# EasyEDA Pro project ProPrj_IoT House_2026-04-28.epro, board PCB6
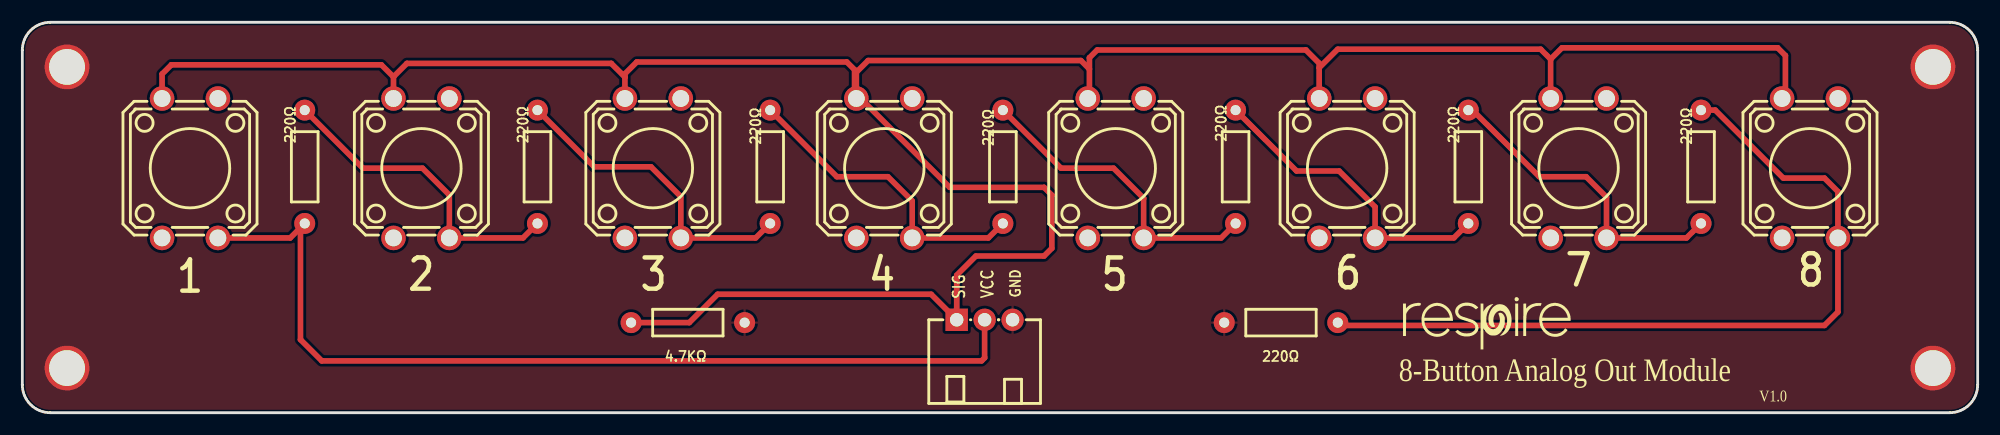
[diagram p11: board, top side]
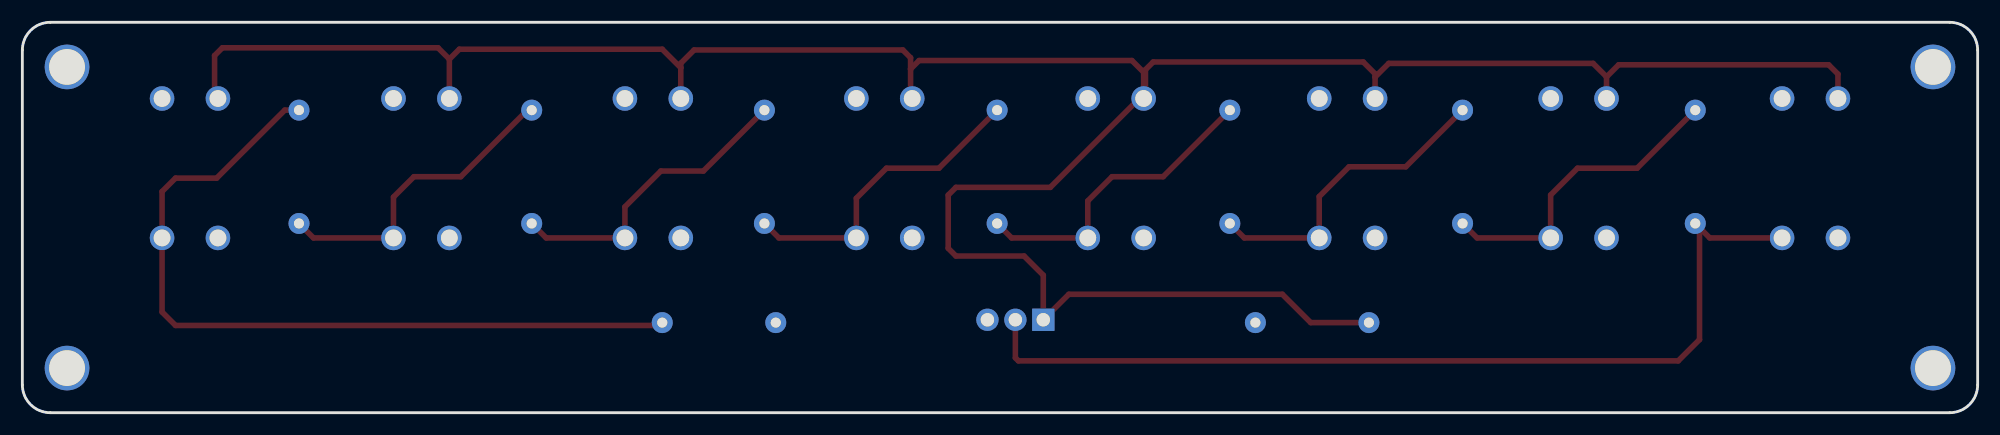
[diagram p12: board, bottom side, seen from below]

Outline 175 x 35 mm; copper layers: Top Layer, Bottom Layer. Coordinates in mm from the lower left corner of the outline.
Outline path: 0,32.5 0,2.5 arc(0.73,0.73) 2.5,0 172.5,0 arc(174.27,0.73) 175,2.5 175,32.5 arc(174.27,34.27) 172.5,35 2.5,35 arc(0.73,34.27) 0,32.5
Stack: Top Layer 0.035mm / Dielectric1 1.51mm FR4 er 4.5 / Bottom Layer 0.035mm

## Design rules (mm)
template: Custom Config
spacing copperThickness1oz (default): track to track 0.102, other pairs 0.152 to 0.3
spacing copperThickness2oz: track to track 0.203, other pairs 0.152 to 0.3
track width copperThickness1oz (default): min 0.127, default 0.5, max 2.54
track width copperThickness2oz: min 0.203, default 0.5, max 2.54
differential pair differentialPair (default): width min 0.127, default 0.254, max 2.54; gap min 0.152, default 0.152
via viaSize (default): diameter min 0.5, default 0.61, max 10; hole min 0.3, default 0.305, max 6.3

## Placement (name value [footprint] x y rotation side)
4.7KΩ  10KΩ  [R_AXIAL-0.4]  59.56 8.08 0 top
220Ω  -  [R_AXIAL-0.4]  46.1 22.05 270 top
220Ω#2  -  [R_AXIAL-0.4]  66.93 22.05 270 top
220Ω#3  -  [R_AXIAL-0.4]  25.27 22.05 270 top
220Ω#4  -  [R_AXIAL-0.4]  87.76 22.05 270 top
220Ω#5  -  [R_AXIAL-0.4]  108.59 22.05 270 top
220Ω#6  -  [R_AXIAL-0.4]  129.41 22.05 270 top
220Ω#7  -  [R_AXIAL-0.4]  150.24 22.05 270 top
220Ω#8  -  [R_AXIAL-0.4]  112.65 8.08 0 top
GND  XH-3AW  [CONN-TH_XH-3AW-C722865]  86.12 8.33 0 top
NOREF  -  [Pad_e208]  171 4 0 top
NOREF#2  -  [Pad_e207]  4 4 0 top
NOREF#3  -  [Pad_e209]  171 31 0 top
NOREF#4  -  [Pad_e203]  4 31 0 top
SW11  K2-1103DP-M4SW-04  [SW-TH_4P-L12.0-W12.0-P5.00-LS12.5_TC-1103XX]  15 21.92 270 top
SW12  K2-1103DP-M4SW-04  [SW-TH_4P-L12.0-W12.0-P5.00-LS12.5_TC-1103XX]  35.72 21.92 270 top
SW13  K2-1103DP-M4SW-04  [SW-TH_4P-L12.0-W12.0-P5.00-LS12.5_TC-1103XX]  56.43 21.92 270 top
SW14  K2-1103DP-M4SW-04  [SW-TH_4P-L12.0-W12.0-P5.00-LS12.5_TC-1103XX]  77.14 21.92 270 top
SW15  K2-1103DP-M4SW-04  [SW-TH_4P-L12.0-W12.0-P5.00-LS12.5_TC-1103XX]  97.86 21.92 270 top
SW16  K2-1103DP-M4SW-04  [SW-TH_4P-L12.0-W12.0-P5.00-LS12.5_TC-1103XX]  118.57 21.92 270 top
SW17  K2-1103DP-M4SW-04  [SW-TH_4P-L12.0-W12.0-P5.00-LS12.5_TC-1103XX]  139.28 21.92 270 top
SW18  K2-1103DP-M4SW-04  [SW-TH_4P-L12.0-W12.0-P5.00-LS12.5_TC-1103XX]  160 21.92 270 top

## Footprints (pads in the part's own frame, mm; a bottom-side part is the same pattern mirrored in y, then rotated)
CONN-TH_XH-3AW-C722865
  rect 2x2 hole 1.2: 1(-2.5,0)
  round 2 hole 1.2: 2(0,0) 3(2.5,0)
Pad_e203
  round 4 hole 3.2: 1(0,0)
Pad_e207
  round 4 hole 3.2: 1(0,0)
Pad_e208
  round 4 hole 3.2: 1(0,0)
Pad_e209
  round 4 hole 3.2: 1(0,0)
R_AXIAL-0.4
  round 1.879 hole 0.899: 1(-5.08,0) 2(5.08,0)
SW-TH_4P-L12.0-W12.0-P5.00-LS12.5_TC-1103XX
  round 2.2 hole 1.5: 1(-6.25,2.5) 2(6.25,2.5) 3(-6.25,-2.5) 4(6.25,-2.5)

## Nets
GND: 4.7KΩ.2 220Ω#8.1 GND.3 NOREF.1 NOREF#2.1 NOREF#3.1 NOREF#4.1
VCC: 220Ω#3.2 GND.2 SW11.2
AO: 4.7KΩ.1 GND.1 SW11.3 SW12.3 SW13.3 SW14.3 SW15.3 SW16.3 SW17.3 SW18.3
$1N1019: 220Ω.2 220Ω#3.1 SW12.2
$1N1026: 220Ω.1 220Ω#2.2 SW13.2
$1N1030: 220Ω#2.1 220Ω#4.2 SW14.2
$1N1045: 220Ω#4.1 220Ω#5.2 SW15.2
$1N1050: 220Ω#5.1 220Ω#6.2 SW16.2
$1N1055: 220Ω#6.1 220Ω#7.2 SW17.2
$1N1060: 220Ω#7.1 220Ω#8.2 SW18.2

Pads without a net: SW11 1 4; SW12 1 4; SW13 1 4; SW14 1 4; SW15 1 4; SW16 1 4; SW17 1 4; SW18 1 4

## Routing (per net, layer and track width the routed paths; a pad name or vN(x,y) marks a point on that pad's centre or on a via; arc(x,y) is an arc through that point)
VCC: length 83.9
  Top Layer w0.5: GND.2 86.12,4.92 85.85,4.65 26.8,4.65 24.89,6.55 24.89,16.58 ; 24.89,16.58 220Ω#3.2 ; 24.89,16.58 23.98,15.67 SW11.2
AO: length 247.2
  Top Layer w0.5: SW16.3 116.07,30.93 ; 116.07,30.93 116.07,31.33 114.87,32.52 96.2,32.52 95.5,31.83 95.5,30.81 ; 116.07,30.93 117.73,32.59 135.89,32.59 136.78,31.69 ; SW11.3 12.5,30.36 13.33,31.19 32.13,31.19 33.22,30.1 ; 4.7KΩ.1 59.69,8.08 62.23,10.62 81.34,10.62 GND.1 83.62,12.33 85.34,14.05 91.44,14.05 92.14,14.74 92.14,19.51 91.44,20.2 83,20.2 75.03,28.17 SW14.3 ; 53.93,30.09 52.7,31.32 34.42,31.32 33.22,30.12 33.22,30.1 ; 53.93,30.09 SW13.3 ; 53.93,30.09 53.93,30.38 54.99,31.44 73.79,31.44 74.48,30.75 74.48,28.33 SW14.3 ; 95.5,30.81 94.74,31.57 75.69,31.57 74.64,30.52 SW14.3 ; 95.5,30.81 95.5,28.32 SW15.3 ; 136.78,31.69 SW17.3 ; 136.78,31.69 136.78,31.7 137.79,32.71 157.1,32.71 157.79,32.02 157.79,28.47 SW18.3 ; 33.22,30.1 SW12.3
$1N1019: length 28.4
  Top Layer w0.5: 220Ω.2 44.8,15.67 SW12.2 38.22,19.52 35.81,21.92 30.48,21.92 220Ω#3.1
$1N1026: length 28.3
  Top Layer w0.5: 220Ω#2.2 65.63,15.67 SW13.2 58.93,19.38 56.26,22.05 51.18,22.05 220Ω.1
$1N1030: length 28.1
  Top Layer w0.5: 220Ω#2.1 72.9,21.16 77.47,21.16 79.64,18.98 SW14.2 86.46,15.67 220Ω#4.2
$1N1045: length 28.2
  Top Layer w0.5: 220Ω#5.2 107.29,15.67 SW15.2 100.36,19.23 97.66,21.92 92.96,21.92 220Ω#4.1
$1N1050: length 27.7
  Top Layer w0.5: 220Ω#6.2 128.12,15.67 SW16.2 121.07,18.45 117.86,21.67 114.05,21.67 220Ω#5.1
$1N1055: length 28.3
  Top Layer w0.5: 220Ω#7.2 148.94,15.67 SW17.2 141.78,19.33 139.95,21.16 135.76,21.16 129.79,27.13 220Ω#6.1
$1N1060: length 71.4
  Top Layer w0.5: 220Ω#7.1 151.51,27.13 157.61,21.03 161.29,21.03 162.5,19.82 SW18.2 162.5,9.03 161.29,7.82 117.98,7.82 220Ω#8.2

## Copper pours and planes (outline as drawn; the poured copper is in the pictures)
GND on Top Layer: 0,35 175.13,35 175.13,-0.18 0,-0.18

## Text on the board
Top Silkscreen Layer: SIG | VCC | 1 | 2 | 3 | 4 | 5 | 6 | 7 | 8 | V1.0 | 8-Button Analog Out Module
